# Altium schematic sheet 1_P1.schdoc
size 307 x 218 mm; Symbol: Drawing-Symbol_A4; Device: Drawing-Symbol_A4; @Project Name: Usb_Hub; @Page Count: 1; @Update Date: 2026-05-25; @Create Date: 2026-05-25; @Schematic Name: Schematic1; @Page No: 1; @Page Name: P1; Company: EasyEDA.com; Version: V1.0; Page Size: A4; @Create Time: 03:37:33; @Update Time: 10:13:48; Width: 1170; Height: 825; Region Start: 1; X Region Count: 6; Y Region Count: 4; Blade Width: 10; Title Block Position: 3; @Board Name: Board1
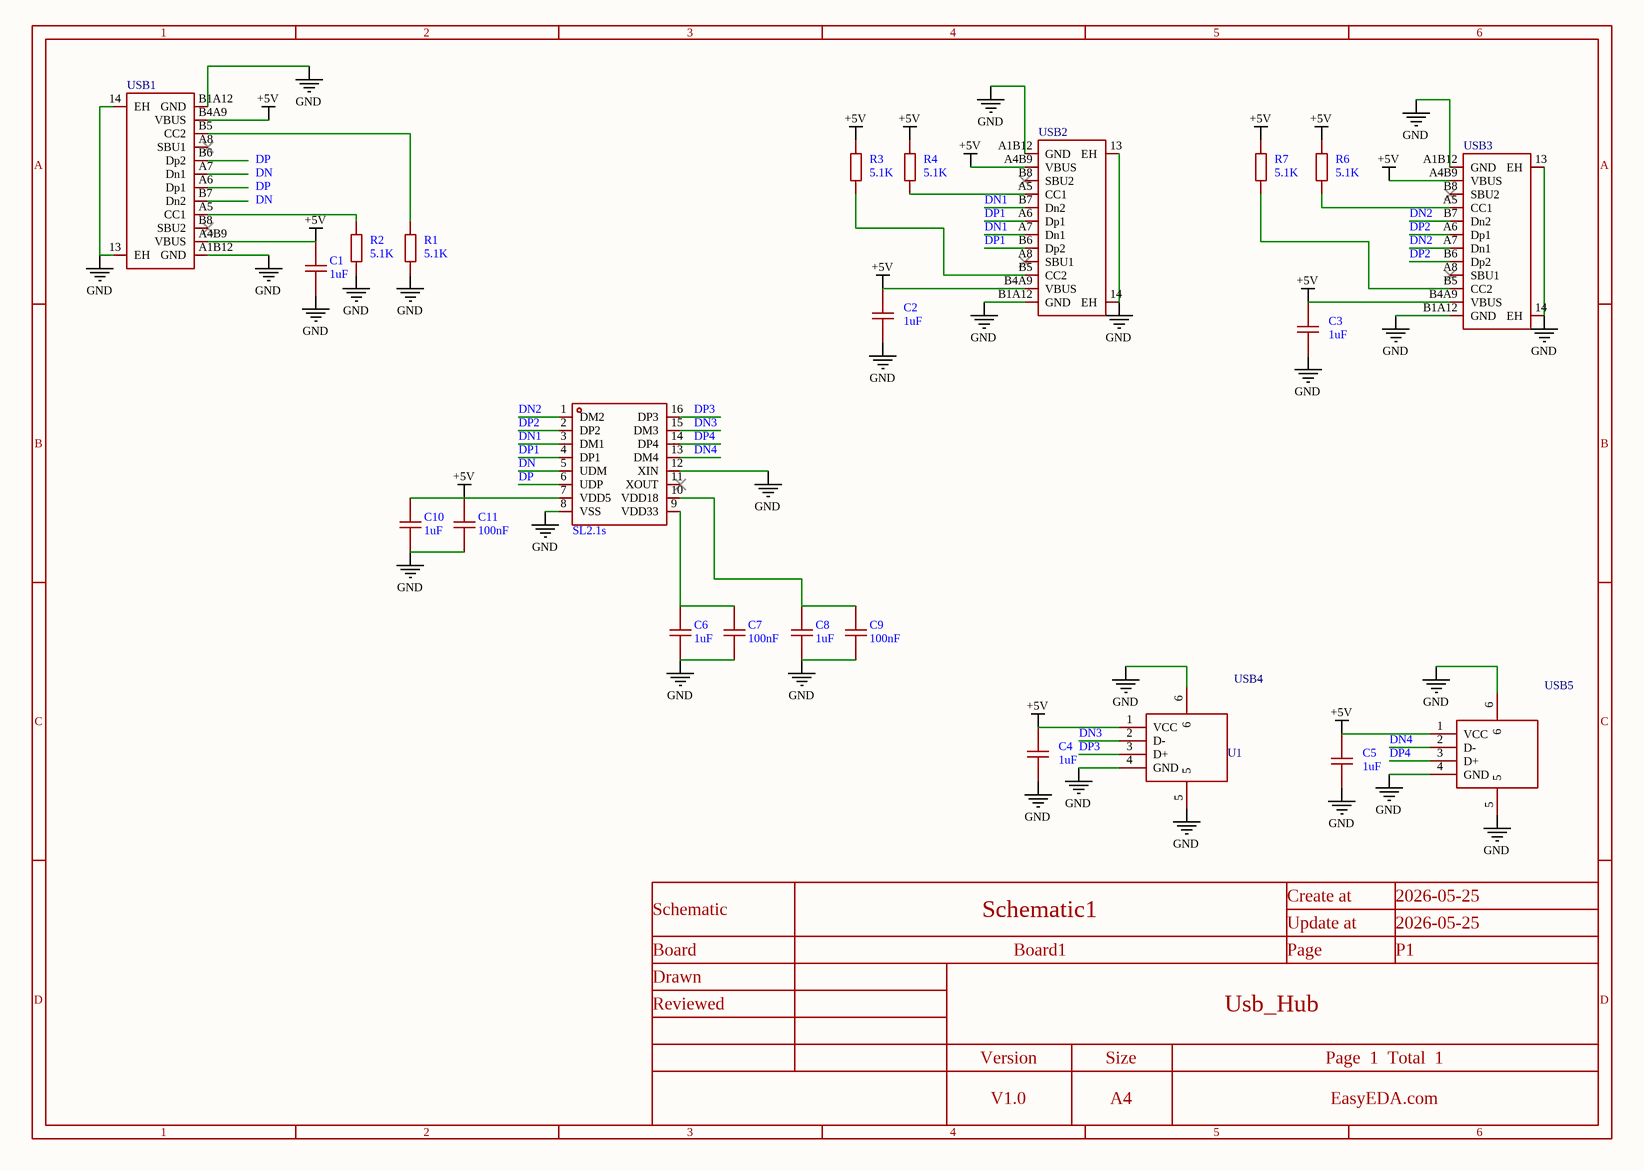
[diagram p0: 1_P1.schdoc]

## Parts
C1  1uF  [C0603]
C2  1uF  [C0603]
C3  1uF  [C0603]
C4  1uF  [C0603]
C5  1uF  [C0603]
C6  1uF  [C0603]
C7  100nF  [C0603]
C8  1uF  [C0603]
C9  100nF  [C0603]
C10  1uF  [C0603]
C11  100nF  [C0603]
R1  5.1K  [R0603]
R2  5.1K  [R0603]
R3  5.1K  [R0603]
R4  5.1K  [R0603]
R6  5.1K  [R0603]
R7  5.1K  [R0603]
U1  SL2.1s  [SSOP-16_L4.6-W2.6-P0.53-LS4.0-BL]
USB1  TYPE-C 16PIN 2MD(073)  [USB-C-SMD_TYPE-C-16PIN-2MD-073]  (value not drawn)
USB2  TYPE-C 16PIN 2MD(073)  [USB-C-SMD_TYPE-C-16PIN-2MD-073]  (value not drawn)
USB3  TYPE-C 16PIN 2MD(073)  [USB-C-SMD_TYPE-C-16PIN-2MD-073]  (value not drawn)
USB4  10.0 QHHTZB6.3  [USB-A-TH_10.0QHHTZB6.3]  (value not drawn)
USB5  10.0 QHHTZB6.3  [USB-A-TH_10.0QHHTZB6.3]  (value not drawn)

## Nets
+5V: C1.1 C2.1 C3.1 C4.1 C5.1 C10.1 C11.1 R3.1 R4.1 R6.1 R7.1 U1.7(VDD5) USB1.A4B9(VBUS) USB1.B4A9(VBUS) USB2.A4B9(VBUS) USB2.B4A9(VBUS) USB3.A4B9(VBUS) USB3.B4A9(VBUS) USB4.1(VCC) USB5.1(VCC)
GND: C1.2 C2.2 C3.2 C4.2 C5.2 C6.2 C7.2 C8.2 C9.2 C10.2 C11.2 R1.1 R2.1 U1.8(VSS) U1.12(XIN) USB1.13(EH) USB1.14(EH) USB1.A1B12(GND) USB1.B1A12(GND) USB2.13(EH) USB2.14(EH) USB2.A1B12(GND) USB2.B1A12(GND) USB3.13(EH) USB3.14(EH) USB3.A1B12(GND) USB3.B1A12(GND) USB4.4(GND) USB4.5 USB4.6 USB5.4(GND) USB5.5 USB5.6
DN: U1.5(UDM)
DN1: U1.3(DM1) USB2.A7(Dn1) USB2.B7(Dn2)
DN2: U1.1(DM2) USB3.A7(Dn1) USB3.B7(Dn2)
DN3: U1.15(DM3) USB4.2(D-)
DN4: U1.13(DM4) USB5.2(D-)
DP: U1.6(UDP)
DP1: U1.4(DP1) USB2.A6(Dp1) USB2.B6(Dp2)
DP2: U1.2(DP2) USB3.A6(Dp1) USB3.B6(Dp2)
DP3: U1.16(DP3) USB4.3(D+)
DP4: U1.14(DP4) USB5.3(D+)
NetC6_1: C6.1 C7.1 U1.9(VDD33)
NetC8_1: C8.1 C9.1 U1.10(VDD18)
NetR1_2: R1.2 USB1.B5(CC2)
NetR2_2: R2.2 USB1.A5(CC1)
NetR3_2: R3.2 USB2.B5(CC2)
NetR4_2: R4.2 USB2.A5(CC1)
NetR6_2: R6.2 USB3.A5(CC1)
NetR7_2: R7.2 USB3.B5(CC2)

Not connected (* = marked no-connect by the designer): U1 11(XOUT)*; USB1 A6(Dp1) A7(Dn1) A8(SBU1)* B6(Dp2) B7(Dn2) B8(SBU2)*; USB2 A8(SBU1)* B8(SBU2)*; USB3 A8(SBU1)* B8(SBU2)*

## Notes on the sheet
- Labels drawn without touching a wire or pin: DN, DP
- 1
- 2
- 3
- 4
- 5
- 6
- A
- B
- C
- Schematic
- Schematic1
- Create at
- Update at
- 2026-05-25
- Board
- Drawn
- Board1
- Page
- P1
- D
- Reviewed
- Version
- Size
- Usb_Hub
- Page  1  Total  1
- V1.0
- A4
- EasyEDA.com

## Library data of the parts
C1-C11 = CAP_0603: Symbol: CAP; Convert to PCB: yes; Device: CAP_0603; Add into BOM: yes; Supplier Footprint: 0603
  C1-C6 C8 C10: Value: 1uF
  C7 C9 C11: Value: 100nF
R1-R4 R6 R7 = Res_0603: Symbol: Res; Convert to PCB: yes; Device: Res_0603; Add into BOM: yes; Supplier Footprint: 0603; Value: 5.1K
U1 = SL2.1s: Manufacturer: CoreChips(和芯润德); Add into BOM: yes; USB Protocol: USB 2.0; Voltage - Supply: 4V~5.25V; Current - Supply: 120mA; Quiescent Supply Current: 2.5mA; Number of Channels: 4; Symbol: SL2.1S; Device: SL2.1s; LCSC Part Name: USB2.0 HUB控制器集成电路; Supplier Part: C2684433; Manufacturer Part: SL2.1s; Supplier Footprint: SSOP-16; JLCPCB Part Class: Extended Part; Datasheet: https://item.szlcsc.com/datasheet/SL2.1s/2782346.html; Supplier: LCSC; Convert to PCB: yes; type: Hub; Data Rate: -; Operating Temperature: 0℃~+70℃; Memory Interface: -
USB1-USB3 = TYPE-C 16PIN 2MD(073): Manufacturer: SHOU HAN(首韩); Add into BOM: yes; Gender: Female; Number of Contacts: 16P; Number of Ports: 1; Current Rating-Power: 3A; Voltage Rating: 5V; Connect-Disconnect Life: 10,000 Cycles; Detection color: Black; Symbol: TYPE-C 16PIN 2MD(073); Device: TYPE-C 16PIN 2MD(073); LCSC Part Name: Type-C 母 卧贴; Supplier Part: C2765186; Manufacturer Part: TYPE-C 16PIN 2MD(073); Supplier Footprint: SMD; JLCPCB Part Class: Extended Part; Datasheet: https://item.szlcsc.com/datasheet/TYPE-C%252016PIN%25202MD(073)/2901843.html; Supplier: LCSC; Convert to PCB: yes; Connector Type: Type-C; Protocol Standard: -; Mounting Type: Surface Mount, Right Angle; Supplementary Features: -; Center Height: -; Length: -; Operating Temperature: -25℃~+85℃
USB4 USB5 = 10.0 QHHTZB6.3: Manufacturer: SHOU HAN(首韩); Add into BOM: yes; Connector Type: Type-A; Protocol Standard: USB 2.0; Gender: Female; Number of Contacts: 4P; Number of Ports: 1; Current Rating-Power: 1.5A; Voltage Rating: 30V; Connect-Disconnect Life: 5,000 times; Detection color: Black; Symbol: 10.0 QHHTZB6.3; Device: 10.0 QHHTZB6.3; LCSC Part Name: 壳长10.0mm; Supplier Part: C668591; Manufacturer Part: 10.0 QHHTZB6.3; Supplier Footprint: SMD; JLCPCB Part Class: Extended Part; Datasheet: https://item.szlcsc.com/datasheet/10.0%2520QHHTZB6.3/698534.html; Supplier: LCSC; Convert to PCB: yes; Mounting Type: Surface Mount, Right Angle; Supplementary Features: -; Center Height: -; Length: 10mm; Operating Temperature: -25℃~+85℃